# Altium schematic sheet [02] - BLOCK DIAGRAM.SchDoc
size A4; Date: 07/05/2016; CheckedBy: Javier Jiménez Pérez; Author: Javier Jiménez; CompanyName: Guilletronic; Organization: Guilletronic; Address1: Calle del Cel Nº14; Address2: Las Colinas; Address3: 08818 Olivella; DocumentNumber: 2; Revision: A; SheetNumber: 2; SheetTotal: 6
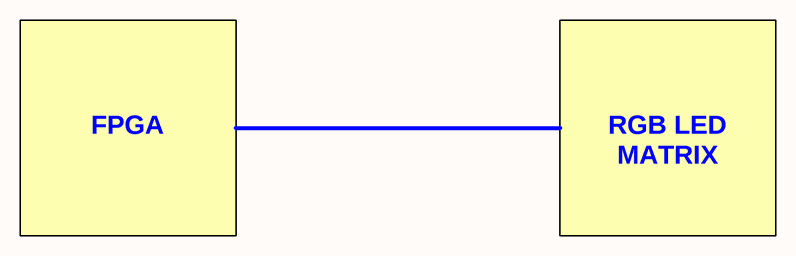
[diagram p0: [02] - BLOCK DIAGRAM.SchDoc]

## Notes on the sheet
- FPGA
- RGB LED MATRIX
- Title
- Size:
- Date:
- Created:
- A4
- Number:
- Time:
- Modified:
- Revision:
- Sheet
- of
- Author:
- File: